# Altium project TemManage.PrjPcb
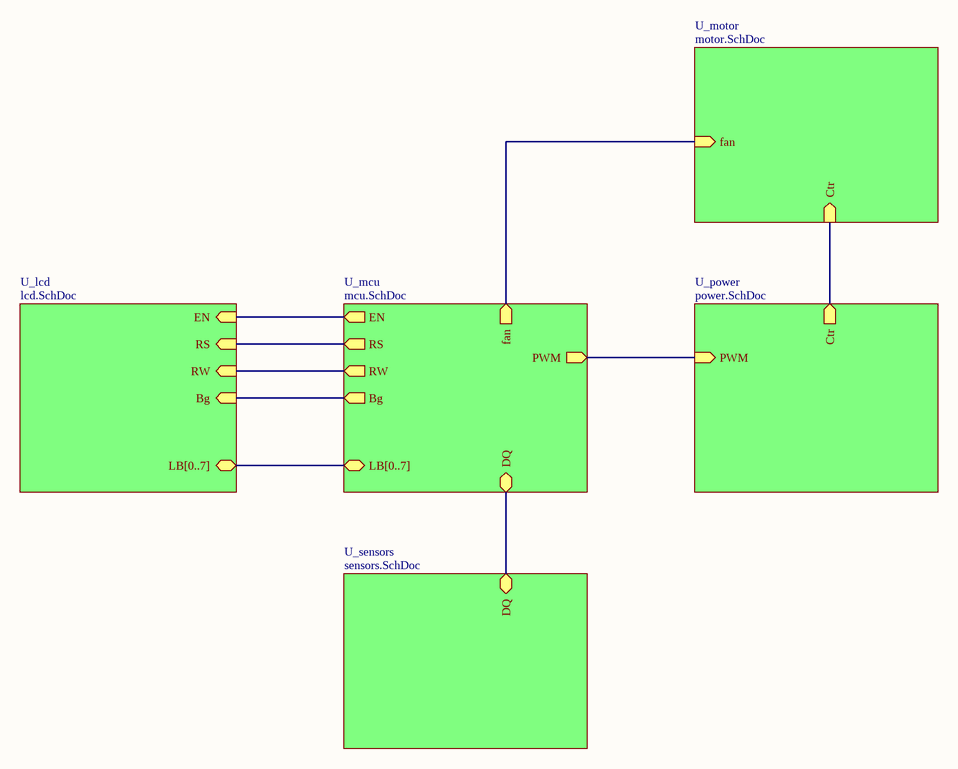
[diagram p0: system.SchDoc]
6 sheets, 43 parts. Net scope: hierarchical (ports join the sheet entries above them; power ports are global).
Board file: system.PcbDoc
Sheets:
  system.SchDoc
    U_mcu = mcu.SchDoc
    U_sensors = sensors.SchDoc
    U_lcd = lcd.SchDoc
    U_motor = motor.SchDoc
    U_power = power.SchDoc

## Sheet system.SchDoc
size A4

### Sub-sheets
U_lcd = lcd.SchDoc: Bg (in), RS (in), RW (in), EN (in), LB[0..7] (bidir)
U_mcu = mcu.SchDoc: RS (out), RW (out), EN (out), PWM (out), Bg (out), LB[0..7] (bidir), fan (out), DQ (bidir)
U_motor = motor.SchDoc: Ctr (in), fan (in)
U_power = power.SchDoc: PWM (in), Ctr (out)
U_sensors = sensors.SchDoc: DQ (bidir)

### Nets
NetLCD_4: sheet U_mcu/RS, sheet U_lcd/RS
NetLCD_5: sheet U_mcu/RW, sheet U_lcd/RW
NetLCD_6: sheet U_mcu/EN, sheet U_lcd/EN
NetR7_1: sheet U_mcu/DQ, sheet U_sensors/DQ
NetR8_1: sheet U_motor/Ctr, sheet U_power/Ctr
NetR9_1: sheet U_mcu/fan, sheet U_motor/fan
NetR10_1: sheet U_mcu/Bg, sheet U_lcd/Bg
NetSW_1: sheet U_mcu/PWM, sheet U_power/PWM

### Buses and harness runs
bus sheet U_lcd/LB[0..7] = sheet U_mcu/LB[0..7]

## Sheet mcu.SchDoc
size A4
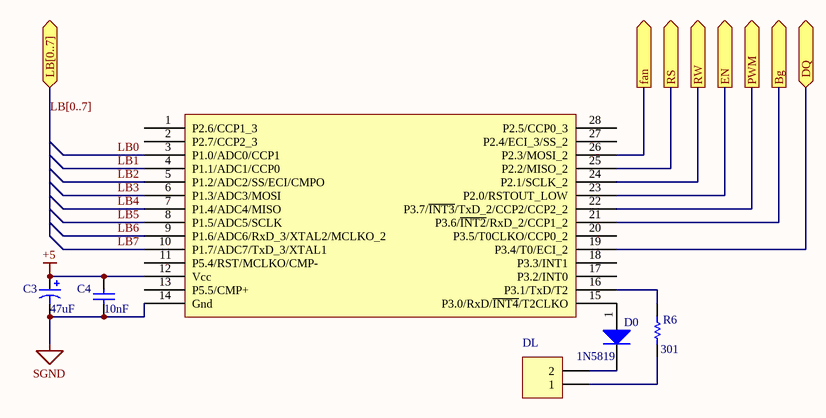
[diagram p1: mcu.SchDoc]

### Parts
C3  value 47uF  [25V47uF(DIP)]  (hidden comment: Cap1)
C4  value 10nF  [0805(M)]  (hidden comment: Cap2)
D0  1N5819  [SMA(M)]
DL  2Pin  [2Pin(DIP)]  (value not drawn)
R6  value 301  [0805(M)]  (hidden comment: Res)
U0  STC15W401AS_SOP28_TSSOP28_SKDIP28  [SOP28]  (value not drawn)

### Ports
Bg (out), DQ (bidir), EN (out), fan (out), LB[0..7] (bidir), PWM (out), RS (out), RW (out)

### Nets
+5: C3.1 C4.2 U0.12(Vcc)
SGND: C3.2 C4.1 U0.14(Gnd)
LB0: U0.3(P1.0/ADC0/CCP1)
LB1: U0.4(P1.1/ADC1/CCP0)
LB2: U0.5(P1.2/ADC2/SS/ECI/CMPO)
LB3: U0.6(P1.3/ADC3/MOSI)
LB4: U0.7(P1.4/ADC4/MISO)
LB5: U0.8(P1.5/ADC5/SCLK)
LB6: U0.9(P1.6/ADC6/RxD_3/XTAL2/MCLKO_2)
LB7: U0.10(P1.7/ADC7/TxD_3/XTAL1)
NetD0_1: D0.1(P) U0.15(P3.0/RxD/~{INT4}/T2CLKO)
NetD0_2: D0.2(N) DL.2
NetDL_1: DL.1 R6.2
NetLCD_4: U0.25(P2.2/MISO_2) ; port RS
NetLCD_5: U0.24(P2.1/SCLK_2) ; port RW
NetLCD_6: U0.23(P2.0/RSTOUT_LOW) ; port EN
NetR6_1: R6.1 U0.16(P3.1/TxD/T2)
NetR7_1: U0.19(P3.4/T0/ECI_2) ; port DQ
NetR9_1: U0.26(P2.3/MOSI_2) ; port fan
NetR10_1: U0.21(P3.6/~{INT2}/RxD_2/CCP1_2) ; port Bg
NetSW_1: U0.22(P3.7/~{INT3}/TxD_2/CCP2/CCP2_2) ; port PWM

Not connected (* = marked no-connect by the designer): U0 1(P2.6/CCP1_3) 2(P2.7/CCP2_3) 11(P5.4/RST/MCLKO/CMP-) 13(P5.5/CMP+) 17(P3.2/INT0) 18(P3.3/INT1) 20(P3.5/T0CLKO/CCP0_2) 27(P2.4/ECI_3/SS_2) 28(P2.5/CCP0_3)

### Buses and harness runs
bus LB[0..7] = port LB[0..7]

### Library data of the parts
C3 = Cap1: 极性电容
C4 = Cap2: 非极性电容
D0 = Diode2: 肖特基二极管

## Sheet sensors.SchDoc
size A4
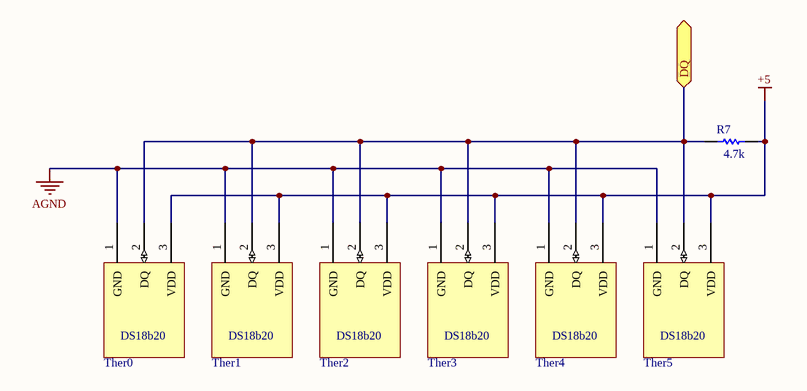
[diagram p2: sensors.SchDoc]

### Parts
R7  value 4.7k  [0805(M)]  (hidden comment: Res)
Ther0  18b20  [TO-92A(DIP)]  (value not drawn)
Ther1  18b20  [TO-92A(DIP)]  (value not drawn)
Ther2  18b20  [TO-92A(DIP)]  (value not drawn)
Ther3  18b20  [TO-92A(DIP)]  (value not drawn)
Ther4  18b20  [TO-92A(DIP)]  (value not drawn)
Ther5  18b20  [TO-92A(DIP)]  (value not drawn)

### Ports
DQ (bidir)

### Nets
+5: R7.2 Ther0.3(VDD) Ther1.3(VDD) Ther2.3(VDD) Ther3.3(VDD) Ther4.3(VDD) Ther5.3(VDD)
AGND: Ther0.1(GND) Ther1.1(GND) Ther2.1(GND) Ther3.1(GND) Ther4.1(GND) Ther5.1(GND)
NetR7_1: R7.1 Ther0.2(DQ) Ther1.2(DQ) Ther2.2(DQ) Ther3.2(DQ) Ther4.2(DQ) Ther5.2(DQ) ; port DQ

### Notes on the sheet
- (in symbol 18b20) DS18b20

### Library data of the parts
Ther0-Ther5 = 18b20: DS18B20 Programmable Resolution 1-Wire® Digital Thermometer

## Sheet lcd.SchDoc
size A4
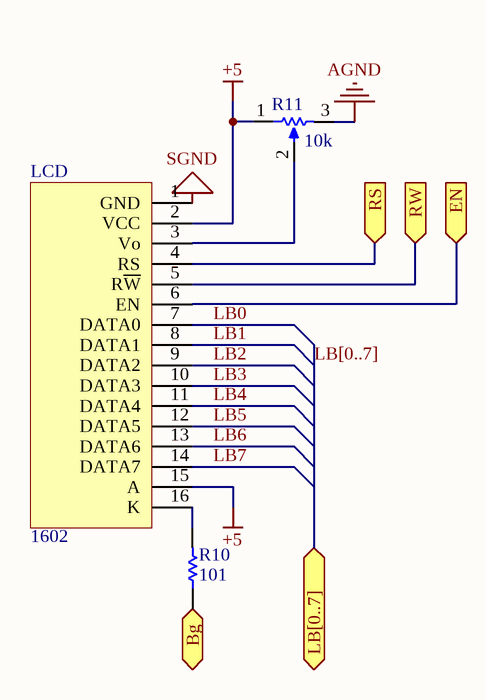
[diagram p3: lcd.SchDoc]

### Parts
LCD  1602  [1602(DIP)]
R10  value 101  [0805(M)]  (hidden comment: Res)
R11  value 10k  [3296W(DIP)]  (hidden comment: Rpot)

### Ports
Bg (in), EN (in), LB[0..7] (bidir), RS (in), RW (in)

### Nets
+5: LCD.2(VCC) LCD.15(A) R11.1(TOP)
AGND: R11.3(BOT)
SGND: LCD.1(GND)
LB0: LCD.7(DATA0)
LB1: LCD.8(DATA1)
LB2: LCD.9(DATA2)
LB3: LCD.10(DATA3)
LB4: LCD.11(DATA4)
LB5: LCD.12(DATA5)
LB6: LCD.13(DATA6)
LB7: LCD.14(DATA7)
NetLCD_3: LCD.3(Vo) R11.2(TAP)
NetLCD_4: LCD.4(RS) ; port RS
NetLCD_5: LCD.5(R~{W}) ; port RW
NetLCD_6: LCD.6(EN) ; port EN
NetLCD_16: LCD.16(K) R10.2
NetR10_1: R10.1 ; port Bg

### Buses and harness runs
bus LB[0..7] = port LB[0..7]

### Library data of the parts
LCD = 1602: lcd1602
R11 = Rpot: 电位计

## Sheet motor.SchDoc
size A4
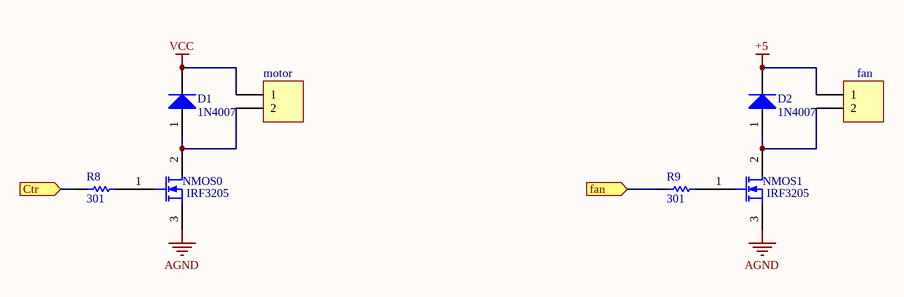
[diagram p4: motor.SchDoc]

### Parts
D1  1N4007  [SMA(M)]
D2  1N4007  [SMA(M)]
NMOS0  IRF3205  [TO-263-3(M)]
NMOS1  IRF3205  [TO-263-3(M)]
R8  value 301  [0805(M)]  (hidden comment: Res)
R9  value 301  [0805(M)]  (hidden comment: Res)
Ter0  motor  [KF301-2P(DIP)]
Ter1  fan  [KF301-2P(DIP)]

### Ports
Ctr (in), fan (in)

### Nets
+5: D2.2(N) Ter1.1
AGND: NMOS0.3(S) NMOS1.3(S)
VCC: D1.2(N) Ter0.1
NetD1_1: D1.1(P) NMOS0.2(D) Ter0.2
NetD2_1: D2.1(P) NMOS1.2(D) Ter1.2
NetNMOS0_1: NMOS0.1(G) R8.2
NetNMOS1_1: NMOS1.1(G) R9.2
NetR8_1: R8.1 ; port Ctr
NetR9_1: R9.1 ; port fan

### Library data of the parts
D1 D2 = Diode1: 整流二极管
NMOS0 NMOS1 = MOSFET-N
Ter0 Ter1 = KF301-2P: 接线端子 脚距5.08MM 300V/16A

## Sheet power.SchDoc
size A4
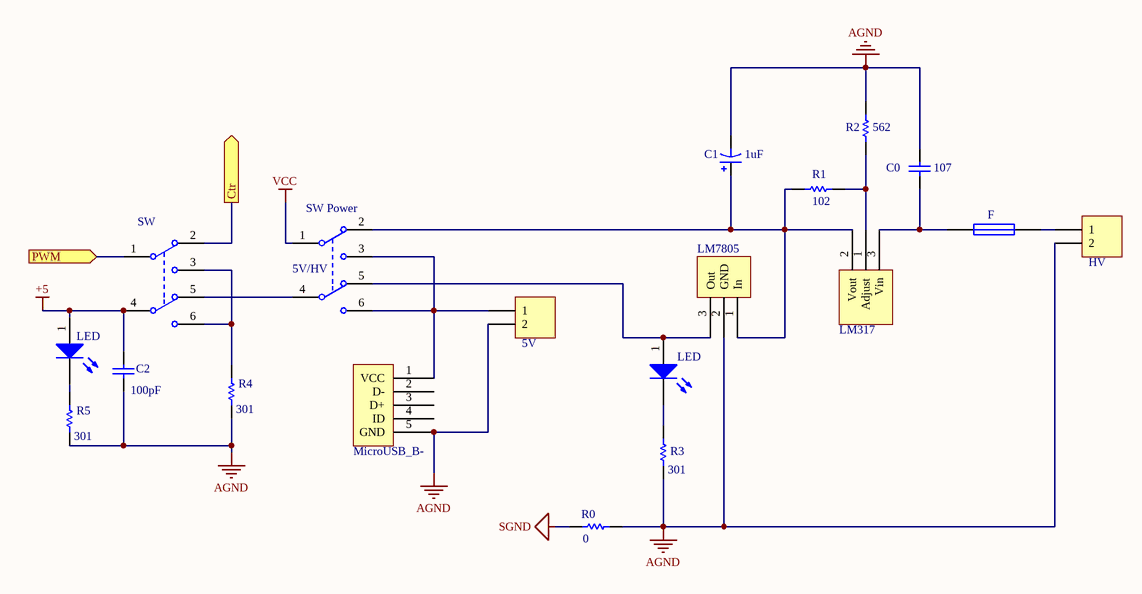
[diagram p5: power.SchDoc]

### Parts
C0  value 107  [0805(M)]  (hidden comment: Cap2)
C1  value 1uF  [25V47uF(DIP)]  (hidden comment: Cap1)
C2  value 100pF  [0805(M)]  (hidden comment: Cap2)
F  Fuse  [1812(M)]  (value not drawn)
LED0  LED  [0805_(M)]
LED1  LED  [0805_(M)]
LM0  LM317  [TO220(DIP)]
LM1  LM7805  [TO220(DIP)]
R0  value 0  [0805(M)]  (hidden comment: Res)
R1  value 102  [0805(M)]  (hidden comment: Res)
R2  value 562  [0805(M)]  (hidden comment: Res)
R3  value 301  [0805(M)]  (hidden comment: Res)
R4  value 301  [0805(M)]  (hidden comment: Res)
R5  value 301  [0805(M)]  (hidden comment: Res)
SW  AFT-03(8*8)  [AFT-03(DIP)]  (value not drawn)
SW_Power  AFT-03(8*8)  [AFT-03(DIP)]  (value not drawn)
Ter2P0  HV  [KF301-2P(DIP)]
Ter2P1  5V  [KF301-2P(DIP)]
USB0  MicroUSB_B-  [MicroUSB_B-(M)]

### Ports
Ctr (out), PWM (in)

### Nets
+5: C2.2 LED1.1(P) SW.4(COMMON2)
AGND: C0.1 C1.2 C2.1 LM1.2(GND) R0.2 R2.2 R3.2 R4.2 R5.2 Ter2P0.2 Ter2P1.2 USB0.5(GND)
SGND: R0.1
VCC: SW_Power.1(COMMON1)
NetC0_2: C0.2 F.1 LM0.3(Vin)
NetC1_1: C1.1 LM0.2(Vout) LM1.1(In) R1.2 SW_Power.2(NC1)
NetF_2: F.2 Ter2P0.1
NetLED0_1: LED0.1(P) LM1.3(Out) SW_Power.5(NC2)
NetLED0_2: LED0.2(N) R3.1
NetLED1_2: LED1.2(N) R5.1
NetLM0_1: LM0.1(Adjust) R1.1 R2.1
NetR4_1: R4.1 SW.3(NO1) SW.6(NO2)
NetR8_1: SW.2(NC1) ; port Ctr
NetSW_1: SW.1(COMMON1) ; port PWM
NetSW_5: SW.5(NC2) SW_Power.4(COMMON2)
NetSW_Power_3: SW_Power.3(NO1) SW_Power.6(NO2) Ter2P1.1 USB0.1(VCC)

Not connected (* = marked no-connect by the designer): USB0 2(D-) 3(D+) 4(ID)

### Notes on the sheet
- (near SW_Power) 5V/HV

### Library data of the parts
C0 C2 = Cap2: 非极性电容
C1 = Cap1: 极性电容
F = Fuse: 保险丝
LM0 = LM317*: 三端稳压(可调)
LM1 = LM7805*: 三端稳压
SW SW_Power = AFT-03(8*8): 双刀双掷(DPDT)
Ter2P0 Ter2P1 = KF301-2P: 接线端子 脚距5.08MM 300V/16A
USB0 = MicroUSB_B-: 母头

## Nets that join several sheets
+5: mcu (C3.1 C4.2 U0.12), sensors (7 pins), lcd (LCD.2 LCD.15 R11.1), motor (D2.2 Ter1.1), power (C2.2 LED1.1 SW.4)
AGND: sensors (6 pins), lcd (R11.3), motor (NMOS0.3 NMOS1.3), power (12 pins)
SGND: mcu (C3.2 C4.1 U0.14), lcd (LCD.1), power (R0.1)
VCC: motor (D1.2 Ter0.1), power (SW_Power.1)
LB0: mcu (U0.3), lcd (LCD.7)
LB1: mcu (U0.4), lcd (LCD.8)
LB2: mcu (U0.5), lcd (LCD.9)
LB3: mcu (U0.6), lcd (LCD.10)
LB4: mcu (U0.7), lcd (LCD.11)
LB5: mcu (U0.8), lcd (LCD.12)
LB6: mcu (U0.9), lcd (LCD.13)
LB7: mcu (U0.10), lcd (LCD.14)
NetLCD_4: mcu (U0.25), lcd (LCD.4)
NetLCD_5: mcu (U0.24), lcd (LCD.5)
NetLCD_6: mcu (U0.23), lcd (LCD.6)
NetR7_1: mcu (U0.19), sensors (7 pins)
NetR8_1: motor (R8.1), power (SW.2)
NetR9_1: mcu (U0.26), motor (R9.1)
NetR10_1: mcu (U0.21), lcd (R10.1)
NetSW_1: mcu (U0.22), power (SW.1)